# Altium project Compact Inverter Driver V5.PrjPcb (part 1 of 2)
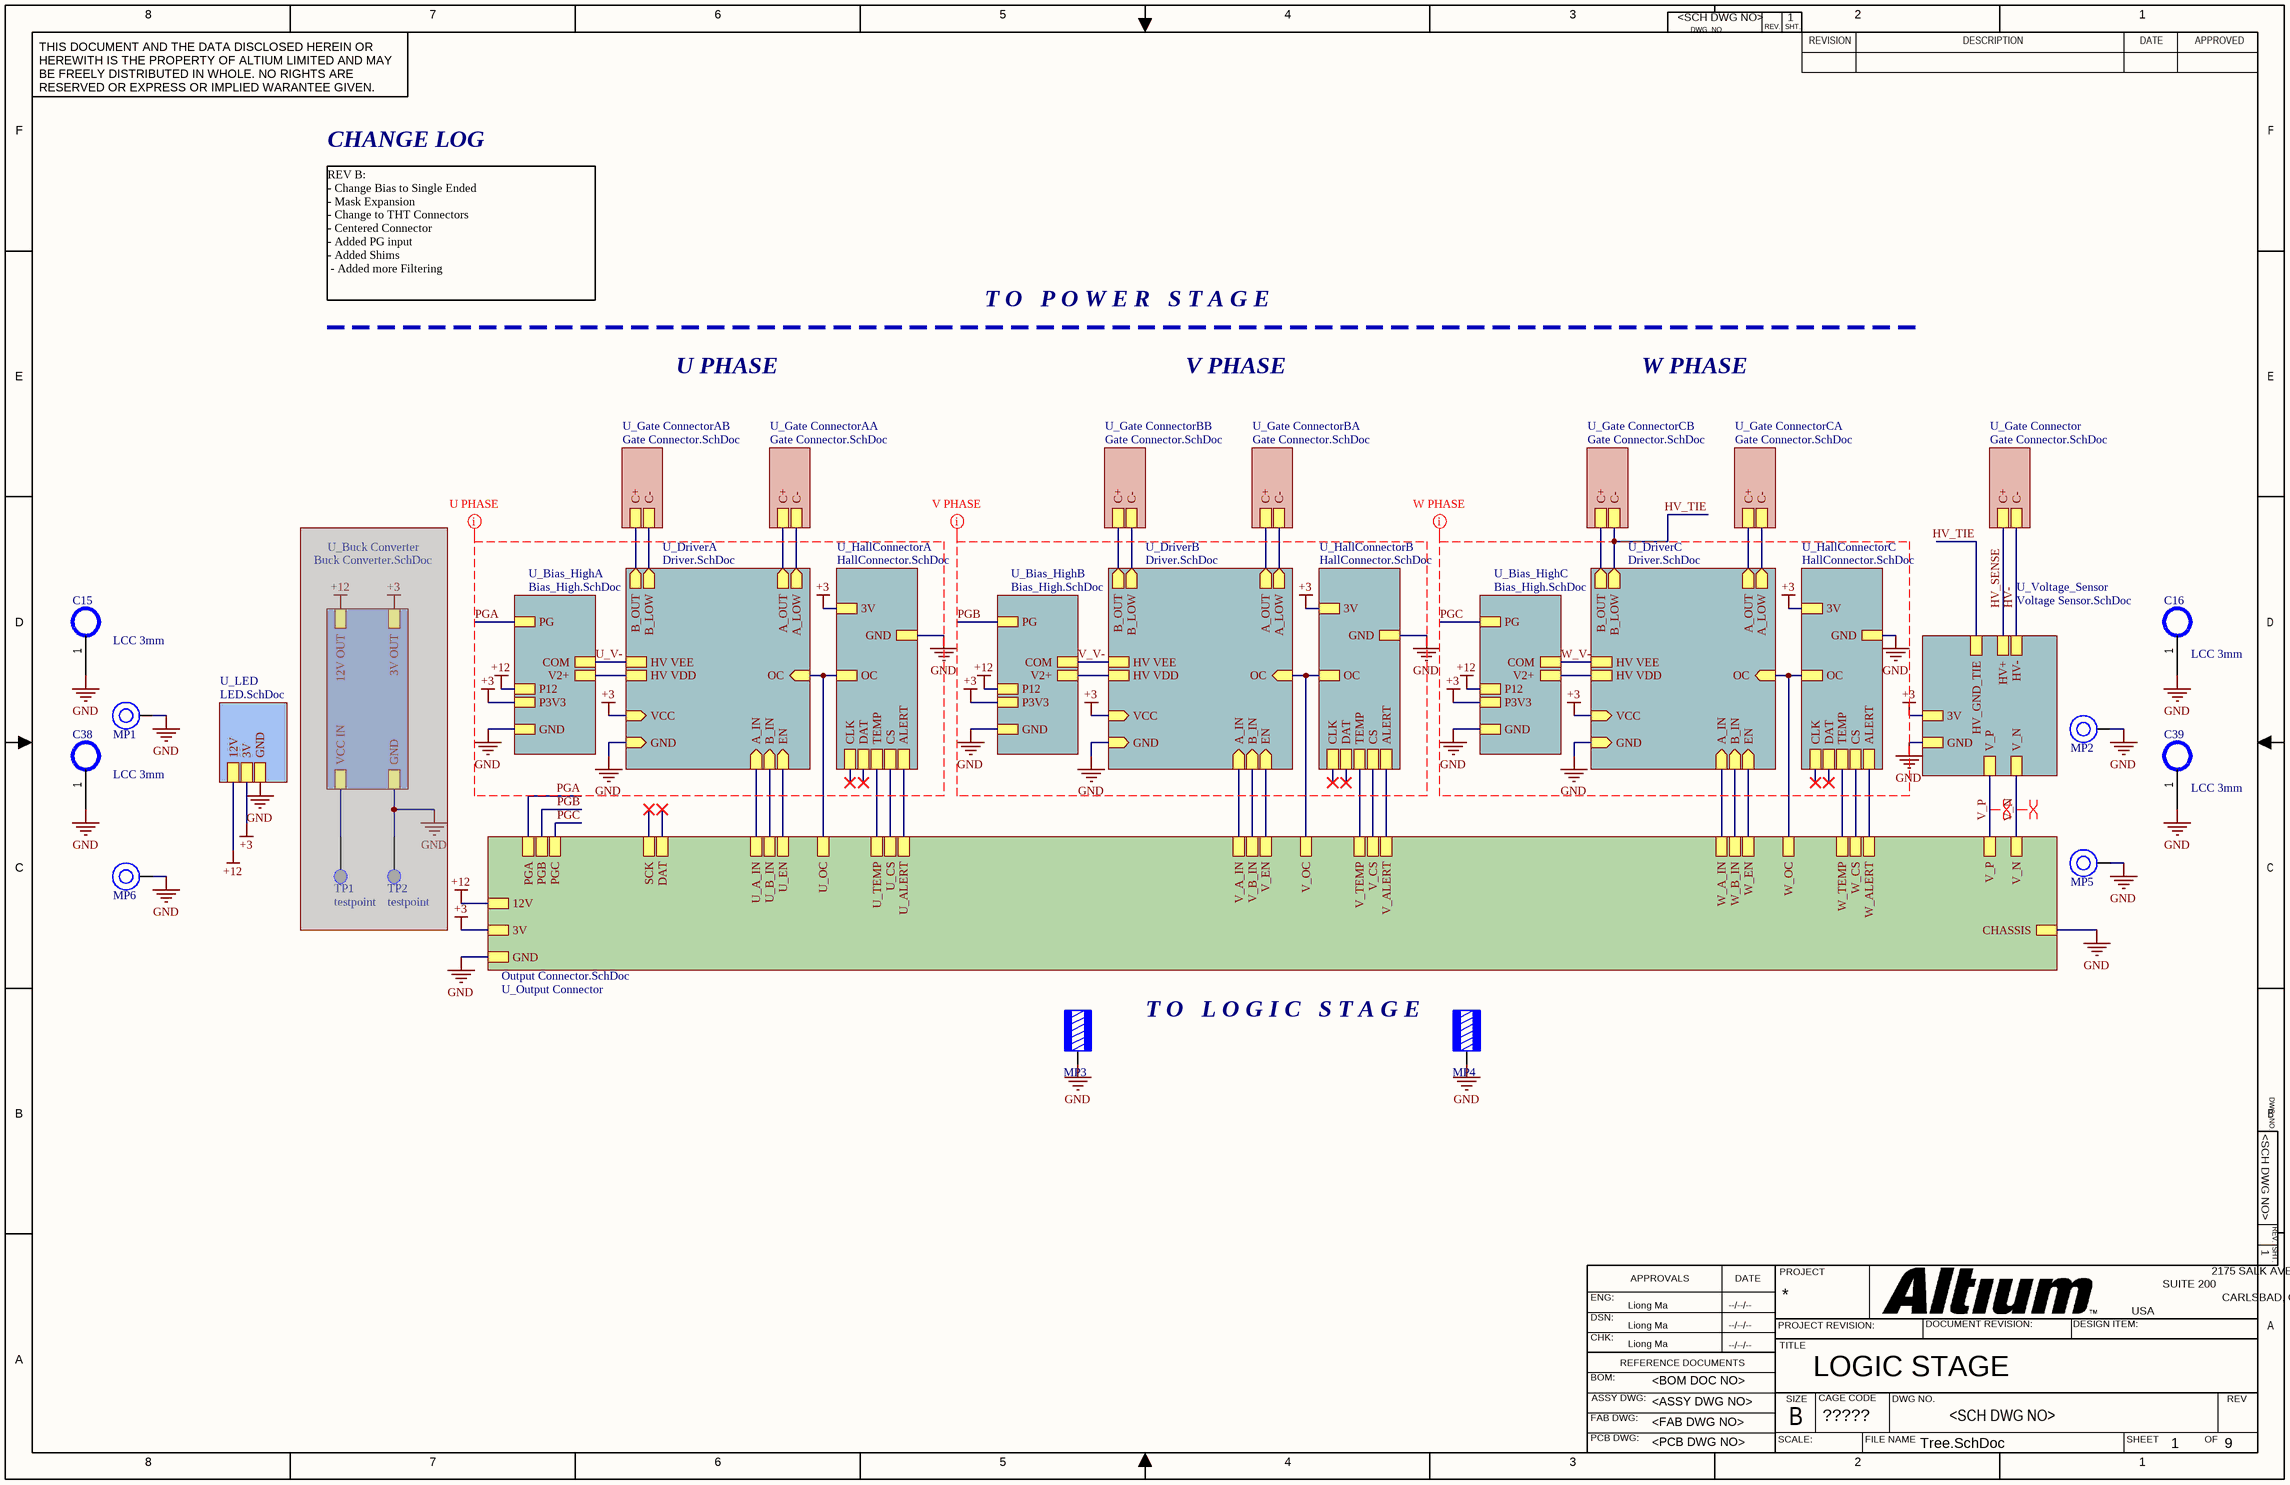
[diagram p0: Tree.SchDoc]
CAGE_CODE: ?????; CONTRACT_NUMBER: <CONTRACT NO>; DOC_NO_ASSY_DWG: <ASSY DWG NO>; DOC_NO_BOM: <BOM DOC NO>; DOC_NO_FAB_DWG: <FAB DWG NO>; DOC_NO_SCH_DWG: <SCH DWG NO>; PCB_2_DEC_TOL: +/-.01; PCB_3_DEC_TOL: +/-.010; PCB_ANG_TOL: +/-1/2; PCB_ASSEMBLY_NO: <PCB ASSY NO>; PCB_CHECKER: - -----; PCB_CHECKER_APP_DATE: --/--/----; PCB_DESIGNER: - -----; PCB_DESIGNER_APP_DATE: --/--/----; PCB_DWG_NO: <PCB DWG NO>; PCB_ENGINEER: - -----; PCB_ENGINEER_APP_DATE: --/--/----; PCB_PART_NUMBER: <PCB PN>; PCB_REV: A; SCH_REV: A
9 sheets, 165 parts. Net scope: strictly hierarchical (ports join the sheet entries above them; power ports are local).
Board file: PCB1.PcbDoc
Sheets:
  Tree.SchDoc
    U_DriverA = Driver.SchDoc
    U_Bias_HighA = Bias_High.SchDoc
    U_HallConnectorA = HallConnector.SchDoc
    U_Gate ConnectorAB = Gate Connector.SchDoc
    U_Gate ConnectorAA = Gate Connector.SchDoc
    U_Output Connector = Output Connector.SchDoc
    U_DriverB = Driver.SchDoc
    U_Bias_HighB = Bias_High.SchDoc
    U_HallConnectorB = HallConnector.SchDoc
    U_Gate ConnectorBB = Gate Connector.SchDoc
    U_Gate ConnectorBA = Gate Connector.SchDoc
    U_DriverC = Driver.SchDoc
    U_Bias_HighC = Bias_High.SchDoc
    U_HallConnectorC = HallConnector.SchDoc
    U_Gate ConnectorCB = Gate Connector.SchDoc
    U_Gate ConnectorCA = Gate Connector.SchDoc
    U_Voltage_Sensor = Voltage Sensor.SchDoc
    U_Gate Connector = Gate Connector.SchDoc
    U_LED = LED.SchDoc

## Sheet Tree.SchDoc: LOGIC STAGE
size 431 x 279 mm; Date: 3/1/25; CheckedBy: Liong Ma; Author: Liong Ma; CompanyName: N/A; DrawnBy: Liong Ma; Engineer: Liong Ma; DocumentNumber: 2; Revision: 1; SheetNumber: 1; SheetTotal: 9; ENG_APP_DATE: --/--/--; DSN_APP_DATE: --/--/--; CHK_APP_DATE: --/--/--

### Parts
C15  LCC 3mm  [PAD 3MM - duplicate]
C16  LCC 3mm  [PAD 3MM - duplicate]
C38  LCC 3mm  [PAD 3MM - duplicate]
C39  LCC 3mm  [PAD 3MM - duplicate]
MP1  M3 x 6.6mm  [9775066360]  (value not drawn)
MP2  M3 x 6.6mm  [9775066360]  (value not drawn)
MP3  M3  [7466313]  (value not drawn)
MP4  M3  [7466313]  (value not drawn)
MP5  M3 x 2.6mm  [9775026360]  (value not drawn)
MP6  M3 x 2.6mm  [9775026360]  (value not drawn)
TP1  testpoint  [testpoint-hook-0805]  (masked out: inside a compile mask, not in the netlist)
TP2  testpoint  [testpoint-hook-0805]  (masked out: inside a compile mask, not in the netlist)

### Sub-sheets
U_Bias_HighA = Bias_High.SchDoc: P12, P3V3, V2+, COM, PG, GND
U_Bias_HighB = Bias_High.SchDoc: P12, P3V3, V2+, COM, PG, GND
U_Bias_HighC = Bias_High.SchDoc: P12, P3V3, V2+, COM, PG, GND
U_Buck Converter = Buck Converter.SchDoc (masked out): VCC IN, GND, 12V OUT, 3V OUT
U_DriverA = Driver.SchDoc: B_OUT (out), B_LOW (out), EN (in), OC (in), A_OUT (out), A_LOW (out), A_IN (in), B_IN (in), VCC (in), GND (in), HV VEE, HV VDD
U_DriverB = Driver.SchDoc: B_OUT (out), B_LOW (out), EN (in), OC (in), A_OUT (out), A_LOW (out), A_IN (in), B_IN (in), VCC (in), GND (in), HV VEE, HV VDD
U_DriverC = Driver.SchDoc: B_OUT (out), B_LOW (out), EN (in), OC (in), A_OUT (out), A_LOW (out), A_IN (in), B_IN (in), VCC (in), GND (in), HV VEE, HV VDD
U_Gate Connector = Gate Connector.SchDoc: C-, C+
U_Gate ConnectorAA = Gate Connector.SchDoc: C-, C+
U_Gate ConnectorAB = Gate Connector.SchDoc: C-, C+
U_Gate ConnectorBA = Gate Connector.SchDoc: C-, C+
U_Gate ConnectorBB = Gate Connector.SchDoc: C-, C+
U_Gate ConnectorCA = Gate Connector.SchDoc: C-, C+
U_Gate ConnectorCB = Gate Connector.SchDoc: C-, C+
U_HallConnectorA = HallConnector.SchDoc: CLK, DAT, CS, 3V, OC, ALERT, GND, TEMP
U_HallConnectorB = HallConnector.SchDoc: CLK, DAT, CS, 3V, OC, ALERT, GND, TEMP
U_HallConnectorC = HallConnector.SchDoc: CLK, DAT, CS, 3V, OC, ALERT, GND, TEMP
U_LED = LED.SchDoc: 12V, 3V, GND
U_Output Connector = Output Connector.SchDoc: U_CS, U_ALERT, U_OC, U_A_IN, U_B_IN, SCK, DAT, 3V, 12V, GND, U_EN, V_CS, V_ALERT, V_OC, V_A_IN, V_B_IN, V_EN, W_CS, W_ALERT, W_OC, W_A_IN, W_B_IN, W_EN, V_P, V_N, CHASSIS, W_TEMP, V_TEMP, U_TEMP, PGA, PGB, PGC
U_Voltage_Sensor = Voltage Sensor.SchDoc: V_P, V_N, HV+, HV-, 3V, GND, HV_GND_TIE

### Nets
+3: sheet U_DriverA/VCC, sheet U_Bias_HighA/P3V3, sheet U_HallConnectorA/3V, sheet U_Output Connector/3V, sheet U_DriverB/VCC, sheet U_Bias_HighB/P3V3, sheet U_HallConnectorB/3V, sheet U_DriverC/VCC, sheet U_Bias_HighC/P3V3, sheet U_HallConnectorC/3V, sheet U_Voltage_Sensor/3V, sheet U_LED/3V  [project net 3V]
+12: sheet U_Bias_HighA/P12, sheet U_Output Connector/12V, sheet U_Bias_HighB/P12, sheet U_Bias_HighC/P12, sheet U_LED/12V  [project net 12V]
GND: C15.1 C16.1 C38.1 C39.1 MP1.1 MP2.1 MP3.1 MP4.1 MP5.1 MP6.1 ; sheet U_DriverA/GND, sheet U_Bias_HighA/GND, sheet U_HallConnectorA/GND, sheet U_Output Connector/GND, sheet U_Output Connector/CHASSIS, sheet U_DriverB/GND, sheet U_Bias_HighB/GND, sheet U_HallConnectorB/GND, sheet U_DriverC/GND, sheet U_Bias_HighC/GND, sheet U_HallConnectorC/GND, sheet U_Voltage_Sensor/GND, sheet U_LED/GND
HV-: sheet U_Voltage_Sensor/HV-, sheet U_Gate Connector/C-
HV_SENSE: sheet U_Voltage_Sensor/HV+, sheet U_Gate Connector/C+
HV_TIE: sheet U_DriverC/B_LOW, sheet U_DriverC/HV VEE, sheet U_Bias_HighC/COM, sheet U_Gate ConnectorCB/C-, sheet U_Voltage_Sensor/HV_GND_TIE  [also labelled W_V-]
J+: sheet U_DriverA/B_OUT, sheet U_Gate ConnectorAB/C+
J+: sheet U_DriverA/A_OUT, sheet U_Gate ConnectorAA/C+  [a separate net that carries the same name]
J+: sheet U_DriverB/B_OUT, sheet U_Gate ConnectorBB/C+  [a separate net that carries the same name]
J+: sheet U_DriverB/A_OUT, sheet U_Gate ConnectorBA/C+  [a separate net that carries the same name]
J+: sheet U_DriverC/B_OUT, sheet U_Gate ConnectorCB/C+  [a separate net that carries the same name]
J+: sheet U_DriverC/A_OUT, sheet U_Gate ConnectorCA/C+  [a separate net that carries the same name]
J-: sheet U_DriverA/A_LOW, sheet U_Gate ConnectorAA/C-
J-: sheet U_DriverB/A_LOW, sheet U_Gate ConnectorBA/C-  [a separate net that carries the same name]
J-: sheet U_DriverC/A_LOW, sheet U_Gate ConnectorCA/C-  [a separate net that carries the same name]
PGA: sheet U_Bias_HighA/PG, sheet U_Output Connector/PGA  [project net FAULT]
PGB: sheet U_Output Connector/PGB, sheet U_Bias_HighB/PG  [project net FAULT]
PGC: sheet U_Output Connector/PGC, sheet U_Bias_HighC/PG  [project net FAULT]
U_V-: sheet U_DriverA/B_LOW, sheet U_DriverA/HV VEE, sheet U_Bias_HighA/COM, sheet U_Gate ConnectorAB/C-  [project net J-]
V_N: sheet U_Output Connector/V_N, sheet U_Voltage_Sensor/V_N
V_P: sheet U_Output Connector/V_P, sheet U_Voltage_Sensor/V_P
V_V-: sheet U_DriverB/B_LOW, sheet U_DriverB/HV VEE, sheet U_Bias_HighB/COM, sheet U_Gate ConnectorBB/C-  [project net J-]
VCC: sheet U_DriverA/HV VDD, sheet U_Bias_HighA/V2+
VCC: sheet U_DriverB/HV VDD, sheet U_Bias_HighB/V2+  [a separate net that carries the same name]
VCC: sheet U_DriverC/HV VDD, sheet U_Bias_HighC/V2+  [a separate net that carries the same name]
NetJ1_U_HallConnectorA_2: sheet U_DriverA/OC, sheet U_HallConnectorA/OC, sheet U_Output Connector/U_OC
NetJ1_U_HallConnectorA_3: sheet U_HallConnectorA/CS, sheet U_Output Connector/U_CS
NetJ1_U_HallConnectorA_6: sheet U_HallConnectorA/ALERT, sheet U_Output Connector/U_ALERT
NetJ1_U_HallConnectorA_8: sheet U_HallConnectorA/TEMP, sheet U_Output Connector/U_TEMP
NetJ1_U_HallConnectorB_2: sheet U_Output Connector/V_OC, sheet U_DriverB/OC, sheet U_HallConnectorB/OC
NetJ1_U_HallConnectorB_3: sheet U_Output Connector/V_CS, sheet U_HallConnectorB/CS
NetJ1_U_HallConnectorB_6: sheet U_Output Connector/V_ALERT, sheet U_HallConnectorB/ALERT
NetJ1_U_HallConnectorB_8: sheet U_Output Connector/V_TEMP, sheet U_HallConnectorB/TEMP
NetJ1_U_HallConnectorC_2: sheet U_Output Connector/W_OC, sheet U_DriverC/OC, sheet U_HallConnectorC/OC
NetJ1_U_HallConnectorC_3: sheet U_Output Connector/W_CS, sheet U_HallConnectorC/CS
NetJ1_U_HallConnectorC_6: sheet U_Output Connector/W_ALERT, sheet U_HallConnectorC/ALERT
NetJ1_U_HallConnectorC_8: sheet U_Output Connector/W_TEMP, sheet U_HallConnectorC/TEMP
NetJ3_02: sheet U_Output Connector/V_A_IN, sheet U_DriverB/A_IN
NetJ3_04: sheet U_Output Connector/V_B_IN, sheet U_DriverB/B_IN
NetJ3_06: sheet U_Output Connector/V_EN, sheet U_DriverB/EN
NetJ3_07: sheet U_Output Connector/W_EN, sheet U_DriverC/EN
NetJ3_09: sheet U_Output Connector/W_B_IN, sheet U_DriverC/B_IN
NetJ3_11: sheet U_Output Connector/W_A_IN, sheet U_DriverC/A_IN
NetJ3_30: sheet U_DriverA/A_IN, sheet U_Output Connector/U_A_IN
NetJ3_32: sheet U_DriverA/B_IN, sheet U_Output Connector/U_B_IN
NetJ3_34: sheet U_DriverA/EN, sheet U_Output Connector/U_EN

### Layout directives
differential pair: V_N, V_P
CompClassName: U PHASE: +3, +12, GND, PGA, U_V-
CompClassName: V PHASE: +3, +12, GND, PGB, V_V-
CompClassName: W PHASE: +3, +12, GND, PGC, W_V-

### Notes on the sheet
- CHANGE LOG
- REV B:
  - Change Bias to Single Ended
  - Mask Expansion
  - Change to THT Connectors
  - Centered Connector
  - Added PG input
  - Added Shims
  - Added more Filtering
- T O   P O W E R   S T A G E
- U PHASE
- V PHASE
- W PHASE
- (near MP4) T O   L O G I C   S T A G E
- 8
- 7
- 6
- 5
- 4
- 3
- DWG. NO.
- REV.
- SHT.
- 2
- 1
- THIS DOCUMENT AND THE DATA DISCLOSED HEREIN OR HEREWITH IS THE PROPERTY OF ALTIUM LIMITED AND MAY BE FREELY DISTRIBUTED IN WHOLE. NO RIGHTS ARE RESERVED OR EXPRESS OR IMPLIED WARANTEE GIVEN.
- REVISION
- DESCRIPTION
- DATE
- APPROVED
- F
- E
- D
- C
- B
- ENG:
- APPROVALS
- PROJECT
- SUITE 200
- 2175 SALK AVENUE
- CARLSBAD, CA 92008
- A
- DSN:
- CHK:
- REFERENCE DOCUMENTS
- PROJECT REVISION:
- TITLE
- DOCUMENT REVISION:
- DESIGN ITEM:
- USA
- BOM:
- FAB DWG:
- PCB DWG:
- ASSY DWG:
- SCALE:
- SIZE
- CAGE CODE
- FILE NAME
- DWG NO.
- SHEET
- OF
- REV

### Library data of the parts
MP1 MP2 = 9775066360R: WA-SMSR SMT Steel Spacer Reverse, M3 x 6.6mm; Manufacturer: Wurth Elektronik; Inside Diameter: 4.2mm; Outside Diameter: 6mm; Surface: Tin; ComponentLink1Description: Website Link; ComponentLink1URL: https://www.we-online.com/redexpert/article/9775066360R?ad; ComponentLink2Description: Datasheet Link; ComponentLink2URL: https://www.we-online.com/redexpert/spec/9775066360R?ad; Manufacturer Part Number: 9775066360R; Category: SMT Spacers; Match Code: WA-SMSR; Mount: Surface Mount; Operating Temperature Max: 150°C; Operating Temperature Min: -55°C; Packaging: Tape and Reel; Material: Steel; Pin Length: 6.6mm; Thread Size: M3
MP3 MP4 = 7466313R: WP-SMRA REDCUBE SMT Right Angled with pins, M3, 50A; Manufacturer: Wurth Elektronik; Surface: Tin; ComponentLink1Description: Website Link; ComponentLink1URL: https://www.we-online.com/redexpert/article/7466313R?ad; ComponentLink2Description: Datasheet Link; ComponentLink2URL: https://www.we-online.com/redexpert/spec/7466313R?ad; Manufacturer Part Number: 7466313R; Category: REDCUBE SMT; Match Code: WP-SMRA; Mount: Surface Mount; Operating Temperature Max: 150°C; Operating Temperature Min: -55°C; Packaging: Tape and Reel; Height: 7mm; Material: Brass; Rated Current: 50A; Thread Size: M3
MP5 MP6 = 9775026360R: WA-SMSR SMT Steel Spacer Reverse, M3 x 2.6mm; Manufacturer: Wurth Elektronik; Inside Diameter: 4.2mm; Outside Diameter: 6mm; Surface: Tin; ComponentLink1Description: Website Link; ComponentLink1URL: https://www.we-online.com/redexpert/article/9775026360R?ad; ComponentLink2Description: Datasheet Link; ComponentLink2URL: https://www.we-online.com/redexpert/spec/9775026360R?ad; Manufacturer Part Number: 9775026360R; Category: SMT Spacers; Match Code: WA-SMSR; Mount: Surface Mount; Operating Temperature Max: 150°C; Operating Temperature Min: -55°C; Packaging: Tape and Reel; Material: Steel; Pin Length: 2.6mm; Thread Size: M3
TP1 TP2 = CMP-022-000000-1: Source: Misc-components.SchLib; Design Item ID: testpoint

## Sheet Driver.SchDoc
size A; SheetNumber: 3; SheetTotal: 9
Used 3 times, as channels U_DriverA, U_DriverB, U_DriverC. Parts and nets are listed once, with the designators drawn on the sheet.
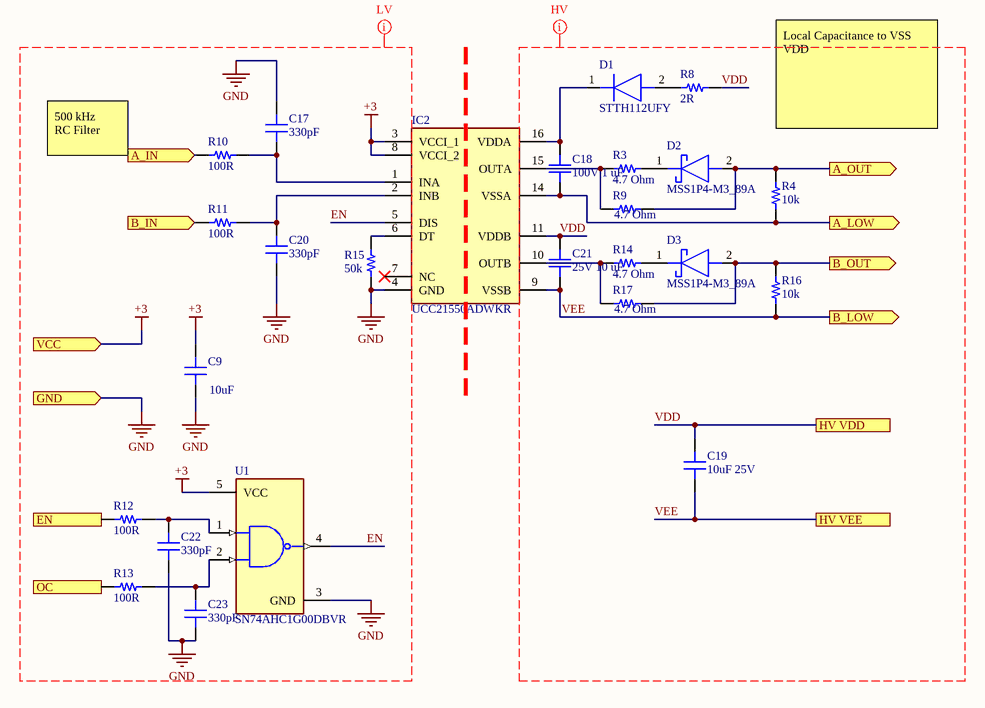
[diagram p1: Driver.SchDoc]

### Parts
C9  10uF  [CAP 0805_2012]
C17  330pF  [CAP 0402_1005]
C18  100V 1 uF  [CAP 1206_3216 - 0.8MM]
C19  10uF 25V  [CAP 1210_3225 - 1MM]
C20  330pF  [CAP 0402_1005]
C21  25V 10 uF  [CAP 1206_3216 - 0.8MM]
C22  330pF  [CAP 0402_1005]
C23  330pF  [CAP 0402_1005]
D1  STTH112UFY  [DIOM5436X110N]
D2  MSS1P4-M3_89A  [MICROSMP]
D3  MSS1P4-M3_89A  [MICROSMP]
IC2  UCC21550ADWKR  [UCC21550ADWKR]
R3  4.7 Ohm  [YAGEO RES 1206_3216]
R4  10k  [RES 0402_1005]
R8  2R  [YAGEO RES 1206_3216]
R9  4.7 Ohm  [YAGEO RES 1206_3216]
R10  100R  [RES 0402_1005]
R11  100R  [RES 0402_1005]
R12  100R  [RES 0402_1005]
R13  100R  [RES 0402_1005]
R14  4.7 Ohm  [YAGEO RES 1206_3216]
R15  50k  [RES 0402_1005]
R16  10k  [RES 0402_1005]
R17  4.7 Ohm  [YAGEO RES 1206_3216]
U1  SN74AHC1G00DBVR  [FP-DBV0005A-MFG]

### Ports
A_IN (in), A_LOW (out), A_OUT (out), B_IN (in), B_LOW (out), B_OUT (out), EN (in), GND (in), HV VDD, HV VEE, OC (in), VCC (in)

### Nets
+3: C9.2 IC2.3(VCCI_1) IC2.8(VCCI_2) U1.5(VCC) ; port VCC
GND: C9.1 C17.2 C20.1 C22.1 C23.1 IC2.4(GND) R15.2 U1.3(GND) ; port GND
A_IN: R10.1 ; port A_IN
A_LOW: C18.1 IC2.14(VSSA) R4.2 ; port A_LOW
A_OUT: D2.2(A) R4.1 R9.2 ; port A_OUT
B_IN: R11.1 ; port B_IN
B_OUT: D3.2(A) R16.1 R17.2 ; port B_OUT
EN: IC2.5(DIS) U1.4(Y)
EN: R12.1 ; port EN  [a separate net that carries the same name]
OC: R13.1 ; port OC
VDD: C19.1 C21.2 IC2.11(VDDB) R8.1 ; port HV VDD
VEE: C19.2 C21.1 IC2.9(VSSB) R16.2 ; port B_LOW, port HV VEE
NetC17_1: C17.1 IC2.1(INA) R10.2
NetC18_2: C18.2 D1.1(K) IC2.16(VDDA)
NetC20_2: C20.2 IC2.2(INB) R11.2
NetC22_2: C22.2 R12.2 U1.1(A)
NetC23_2: C23.2 R13.2 U1.2(B)
NetD1_2: D1.2(A) R8.2
NetD2_1: D2.1(K) R3.2
NetD3_1: D3.1(K) R14.2
NetIC2_6: IC2.6(DT) R15.1
NetIC2_10: IC2.10(OUTB) R14.1 R17.1
NetIC2_15: IC2.15(OUTA) R3.1 R9.1

Not connected (* = marked no-connect by the designer): IC2 7(NC)*

### Channels
U_DriverA: designators end in _U_DriverA; ports A_IN=NetJ3_30 A_LOW=J- A_OUT=J+ B_IN=NetJ3_32 B_LOW=J- B_OUT=J+ EN=NetJ3_34 GND=GND HV VDD=VCC HV VEE=J- OC=NetJ1_U_HallConnectorA_2 VCC=3V
U_DriverB: designators end in _U_DriverB; ports A_IN=NetJ3_02 A_LOW=J- A_OUT=J+ B_IN=NetJ3_04 B_LOW=J- B_OUT=J+ EN=NetJ3_06 GND=GND HV VDD=VCC HV VEE=J- OC=NetJ1_U_HallConnectorB_2 VCC=3V
U_DriverC: designators end in _U_DriverC; ports A_IN=NetJ3_11 A_LOW=J- A_OUT=J+ B_IN=NetJ3_09 B_LOW=HV_TIE B_OUT=J+ EN=NetJ3_07 GND=GND HV VDD=VCC HV VEE=HV_TIE OC=NetJ1_U_HallConnectorC_2 VCC=3V

### Layout directives
net class HV: VDD, VEE
net class LV: +3, EN, GND

### Notes on the sheet
- 500 kHz
  RC Filter
- Local Capacitance to VSS VDD

### Library data of the parts
C9 = CGA4J3X7R1C155M125AB: CAP CER 1.5UF 16V X7R 0805; manufacturer: TDK Corporation; Capacitance: 1.5 µF; Tolerance: ±20%; value: 1.5 µF; Part Number: CGA4J3X7R1C155M125AB; Applications: Automotive; componentlink1description: Datasheet; componentlink1url: https://product.tdk.com/info/en/catalog/datasheets/mlcc_automotive_general_en.pdf?ref_disty=digikey; componentlink2description: DigiKey Link; componentlink2url: https://www.digikey.com/en/products/detail/tdk-corporation/CGA4J3X7R1C155M125AB/3949968; Device Package: 0805 (2012 Metric); lastupdated: 2/9/2024 8:15:20 PM; Lifecycle Status: Active; Minimum Order: 1; Mounting Type: Surface Mount, MLCC; Operating Temperature: -55°C ~ 125°C; Package / Case: 0805 (2012 Metric); packaging: TapeAndReel; partid: 18072; Part Status: Active; price: 0.04; Ratings: AEC-Q200; series: CGA; Size / Dimension: 0.079" L x 0.049" W (2.00mm x 1.25mm); Supplier 1: DigiKey; Supplier Part Number 1: 445-12732-1-ND; Temperature Coefficient: X7R; Thickness (Max): 0.057" (1.45mm); Voltage - Rated: 16V
C17 C20 C22 C23 = ZRB157R61E225KE11D: CAP CER 2F 25V X5R 0402; manufacturer: Murata Electronics; Capacitance: 2.2 µF; Tolerance: ±10%; value: 2.2 µF; Part Number: ZRB157R61E225KE11D; Applications: Acoustic Noise Reduction; componentlink1description: Datasheet; componentlink1url: https://search.murata.co.jp/Ceramy/image/img/A01X/G101/ENG/ZRB157R61E225KE11-01.pdf; componentlink2description: DigiKey Link; componentlink2url: https://www.digikey.com/en/products/detail/murata-electronics/ZRB157R61E225KE11D/5321074; Device Package: 0402 (1005 Metric); Features: Interposer Termination; lastupdated: 2/9/2024 8:04:27 PM; Lifecycle Status: Active; Minimum Order: 1; Mounting Type: Surface Mount, MLCC; Operating Temperature: -55°C ~ 85°C; Package / Case: 0402 (1005 Metric); packaging: TapeAndReel; partid: 8590; Part Status: Active; price: 0.04; series: ZRB; Size / Dimension: 0.039" L x 0.020" W (1.00mm x 0.50mm); Supplier 1: DigiKey; Supplier Part Number 1: 490-10982-1-ND; Temperature Coefficient: X5R; Thickness (Max): 0.033" (0.85mm); Voltage - Rated: 25V
C18 C21 = VPDD631W103K1GV001E: HV CAP 0.01F 630V 1206 X7R; manufacturer: Johanson Dielectrics Inc.; Capacitance: 10000 pF; Tolerance: ±10%; value: 10000 pF; Part Number: VPDD631W103K1GV001E; Applications: General Purpose; componentlink1description: Datasheet; componentlink1url: https://www.johansondielectrics.com/datasheets/export/e1.php?name=VPDD631W103K1GV001E; componentlink2description: DigiKey Link; componentlink2url: https://www.digikey.com/en/products/detail/johanson-dielectrics-inc/VPDD631W103K1GV001E/21283575; Device Package: 1206 (3216 Metric); Features: High Voltage; lastupdated: 6/4/2024 7:09:59 PM; Lifecycle Status: Active; Minimum Order: 1; Mounting Type: Surface Mount, MLCC; Operating Temperature: -55°C ~ 125°C; Package / Case: 1206 (3216 Metric); packaging: TapeAndReel; partid: 57082; price: 0.02; series: HVS-PME; Size / Dimension: 0.125" L x 0.062" W (3.17mm x 1.57mm); Supplier 1: DigiKey; Supplier Part Number 1: 709-VPDD631W103K1GV001ECT-ND; Temperature Coefficient: X7R; Thickness (Max): 0.067" (1.70mm); Voltage - Rated: 630V
C19 = MSAST32NSB5106MTNA01: CAP CER 10UF 25V X5R 1210; manufacturer: Taiyo Yuden; Value: 10 µF; Tolerance: ±20%; Part Number: MSAST32NSB5106MTNA01; Applications: SMPS Filtering; Capacitance: 10 µF; componentlink1description: Datasheet; componentlink1url: https://mm.digikey.com/Volume0/opasdata/d220001/medias/docus/5731/MSR01_e.pdf; componentlink2description: DigiKey Link; componentlink2url: https://www.digikey.com/en/products/detail/taiyo-yuden/MSAST32NSB5106MTNA01/16661899; Device Package: 1210 (3225 Metric); lastupdated: 6/4/2024 7:20:40 PM; Lifecycle Status: Active; Minimum Order: 1; Mounting Type: Surface Mount, MLCC; Operating Temperature: -55°C ~ 85°C; Package / Case: 1210 (3225 Metric); packaging: TapeAndReel; partid: 58126; price: 0.08; series: MSAS; Size / Dimension: 0.126" L x 0.098" W (3.20mm x 2.50mm); Supplier 1: DigiKey; Supplier Part Number 1: 587-MSAST32NSB5106MTNA01CT-ND; Temperature Coefficient: X5R; Thickness (Max): 0.083" (2.10mm); Voltage - Rated: 25V
D1 = STTH112UFY: Diode; Manufacturer_Name: STMicroelectronics; Datasheet Link: https://www.st.com/resource/en/datasheet/stth112-y.pdf; Height: 1.1mm; Manufacturer_Part_Number: STTH112UFY; Mouser Part Number: 511-STTH112UFY; Mouser Price/Stock: https://www.mouser.co.uk/ProductDetail/STMicroelectronics/STTH112UFY?qs=DqCdCwOw4%2F7HJr4wLNNIMw%3D%3D; Arrow Part Number: STTH112UFY; Arrow Price/Stock: https://www.arrow.com/en/products/stth112ufy/stmicroelectronics?region=europe
D2 D3 = MSS1P4-M3_89A: Schottky Diode; Manufacturer_Name: Vishay; Manufacturer_Part_Number: MSS1P4-M3/89A; Datasheet Link: https://www.vishay.com/docs/89019/mss1p4.pdf; Mouser Part Number: 625-MSS1P4-M3; Mouser Price/Stock: https://www.mouser.co.uk/ProductDetail/Vishay-General-Semiconductor/MSS1P4-M3-89A?qs=fLSHF8TigmUkO6GnwlXAxQ%3D%3D; Arrow Part Number: MSS1P4-M3/89A; Arrow Price/Stock: https://www.arrow.com/en/products/mss1p4-m389a/vishay?utm_currency=USD&region=nac
IC2 = UCC21550ADWKR: Integrated Circuit; Manufacturer_Name: Texas Instruments; Datasheet Link: https://www.ti.com/lit/gpn/UCC21550; Height: 2.65mm; Manufacturer_Part_Number: UCC21550ADWKR; Mouser Part Number: 595-UCC21550ADWKR; Mouser Price/Stock: https://www.mouser.co.uk/ProductDetail/Texas-Instruments/UCC21550ADWKR?qs=IKkN%2F947nfBAXILs21qR6A%3D%3D; Arrow Part Number: UCC21550ADWKR; Arrow Price/Stock: https://www.arrow.com/en/products/ucc21550adwkr/texas-instruments?utm_currency=USD&region=nac
R3 R8 R9 R14 R17 = RL1206FR-7W0R1L: RES 0.1 OHM 1% 1/2W 1206; Manufacturer: Yageo; Power (Watts): 0.5W, 1/2W; Resistance: 100 mOhms; Temperature Coefficient: ±600ppm/°C; Value: 100 mOhms; Part Number: RL1206FR-7W0R1L; ComponentLink1Description: Datasheet; ComponentLink1URL: http://www.yageo.com/documents/recent/PYu-RL_Group_521_RoHS_L_2.pdf; ComponentLink2Description: DigiKey Link; ComponentLink2URL: https://www.digikey.com/en/products/detail/yageo/RL1206FR-7W0R1L/2827682; Composition: Thick Film; Device Package: 1206 (3216 Metric); Features: Current Sense; Height - Seated (Max): 0.026" (0.65mm); LastUpdated: 7/25/2024 9:21:39 AM; Lifecycle Status: Active; Minimum Order: 1; Number of Terminations: 2; Operating Temperature: -55°C ~ 125°C; Package / Case: 1206 (3216 Metric); Packaging: TapeAndReel; PartId: 26837; Part Status: Active; Price: 0.08; Ratings: AEC-Q200; Series: RL; Size / Dimension: 0.122" L x 0.063" W (3.10mm x 1.60mm); Supplier 1: DigiKey; Supplier Part Number 1: 311-0.1LYCT-ND; Supplier Device Package: 1206; Tolerance: ±1%
R4 R10-R13 R15 R16 = RP73PF1E249KBTD: RES 249K OHM 0.1% 1/10W 0402; Manufacturer: TE Connectivity Passive Product; Value: 249 kOhms; Power (Watts): 0.1W, 1/10W; Temperature Coefficient: ±25ppm/°C; Part Number: RP73PF1E249KBTD; ComponentLink1Description: Datasheet; ComponentLink1URL: https://www.te.com/commerce/DocumentDelivery/DDEController?Action=srchrtrv&DocNm=1773272&DocType=DS&DocLang=English; ComponentLink2Description: DigiKey Link; ComponentLink2URL: https://www.digikey.com/en/products/detail/te-connectivity-passive-product/RP73PF1E249KBTD/8261091; Composition: Thin Film; Device Package: 0402 (1005 Metric); Height - Seated (Max): 0.014" (0.35mm); LastUpdated: 2/9/2024 8:30:24 PM; Lifecycle Status: Active; Minimum Order: 1; Number of Terminations: 2; Operating Temperature: -55°C ~ 155°C; Package / Case: 0402 (1005 Metric); Packaging: TapeAndReel; PartId: 2418; Part Status: Active; Price: 0.07; Resistance: 249 kOhms; Series: RP73, Holsworthy; Size / Dimension: 0.039" L x 0.020" W (1.00mm x 0.50mm); Supplier 1: DigiKey; Supplier Part Number 1: A127549CT-ND; Supplier Device Package: 0402; Tolerance: ±0.1%
U1 = CMP-0859-00172-4: IC GATE NAND 1CH 2-INP SOT23-5; Manufacturer: Texas Instruments; Standoff Height: 0mm; Number Of Outputs: 1; Nominal Supply Current: 1uA; Max Junction Temp: +150°C; Propagation Delay: 5.2ns; Min Supply Voltage: 2V; Max Supply Voltage: 5.5V; Number Of Inputs: 2; Category: IC; Logic Function Desc: NAND; Ambient Temperature Range High: +125°C; Automotive: No; Octopart: https://octopart.com/sn74ahc1g00dbvr-texas+instruments-464400; Device Class L1: Integrated Circuits (ICs); Device Class L2: Logic ICs; RoHS: TRUE; Height: 1.45mm; Digikey Description: IC GATE NAND 1CH 2-INP SOT23-5; Lead Free: Yes; Ambient Temperature Range Low: -40°C; Number Of Circuits: 1; Device Class L3: Logic Gates; Package: DBV0005A; Manufacturer Part Number: SN74AHC1G00DBVR; ComponentLink2URL: https://www.ti.com/lit/ds/symlink/sn74ahc1g00.pdf; Temperature Range Low: -40°C; Temperature: -40°C to +125°C; Temperature Range High: +125°C; ComponentLink2Description: Datasheet

## Sheet Bias_High.SchDoc
size A; SheetNumber: 2; SheetTotal: 9
Used 3 times, as channels U_Bias_HighA, U_Bias_HighB, U_Bias_HighC. Parts and nets are listed once, with the designators drawn on the sheet.
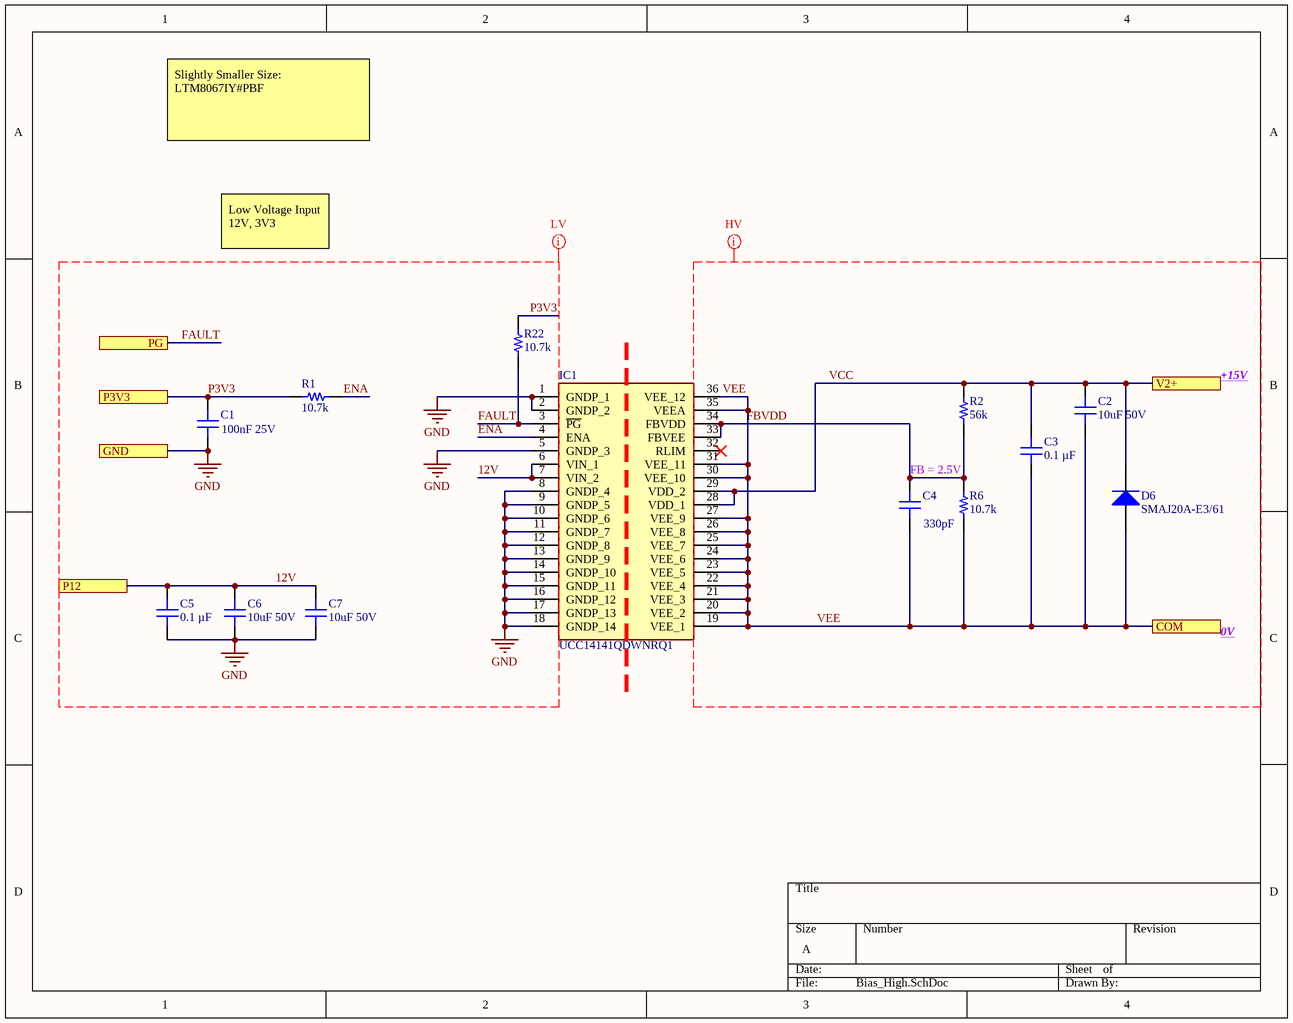
[diagram p2: Bias_High.SchDoc]

### Parts
C1  100nF 25V  [CAP 0402_1005]
C2  10uF 50V  [CAP 1210_3225 - 1MM]
C3  0.1 µF  [CAP 0603_1608]
C4  330pF  [CAP 0402_1005]
C5  0.1 µF  [CAP 0603_1608]
C6  10uF 50V  [CAP 1210_3225 - 1MM]
C7  10uF 50V  [CAP 1210_3225 - 1MM]
D6  SMAJ20A-E3/61  [VISH-DO-214AC-2_M]
IC1  UCC14141QDWNRQ1  [SOP65P1030X355-36N]
R1  10.7k  [RES 0402_1005]
R2  56k  [RES 0402_1005]
R6  10.7k  [RES 0402_1005]
R22  10.7k  [RES 0402_1005]

### Ports
COM, GND, P3V3, P12, PG, V2+

### Nets
GND: C1.1 C5.1 C6.2 C7.2 IC1.1(GNDP_1) IC1.2(GNDP_2) IC1.5(GNDP_3) IC1.8(GNDP_4) IC1.9(GNDP_5) IC1.10(GNDP_6) IC1.11(GNDP_7) IC1.12(GNDP_8) IC1.13(GNDP_9) IC1.14(GNDP_10) IC1.15(GNDP_11) IC1.16(GNDP_12) IC1.17(GNDP_13) IC1.18(GNDP_14) ; port GND
12V: C5.2 C6.1 C7.1 IC1.6(VIN_1) IC1.7(VIN_2) ; port P12
ENA: IC1.4(ENA) R1.1
FAULT: IC1.3(~{PG}) R22.2 ; port PG
FBVDD: C4.2 IC1.33(FBVEE) IC1.34(FBVDD) R2.1 R6.2
P3V3: C1.2 R1.2 R22.1 ; port P3V3
VCC: C2.1 C3.2 D6.1(K) IC1.28(VDD_1) IC1.29(VDD_2) R2.2 ; port V2+
VEE: C2.2 C3.1 C4.1 D6.2(A) IC1.19(VEE_1) IC1.20(VEE_2) IC1.21(VEE_3) IC1.22(VEE_4) IC1.23(VEE_5) IC1.24(VEE_6) IC1.25(VEE_7) IC1.26(VEE_8) IC1.27(VEE_9) IC1.30(VEE_10) IC1.31(VEE_11) IC1.35(VEEA) IC1.36(VEE_12) R6.1 ; port COM

Not connected (* = marked no-connect by the designer): IC1 32(RLIM)*

### Channels
U_Bias_HighA: designators end in _U_Bias_HighA; ports COM=J- GND=GND P3V3=3V P12=12V PG=FAULT V2+=VCC
U_Bias_HighB: designators end in _U_Bias_HighB; ports COM=J- GND=GND P3V3=3V P12=12V PG=FAULT V2+=VCC
U_Bias_HighC: designators end in _U_Bias_HighC; ports COM=HV_TIE GND=GND P3V3=3V P12=12V PG=FAULT V2+=VCC

### Layout directives
net class HV: FBVDD, VCC, VEE
net class LV: 12V, ENA, FAULT, GND, P3V3

### Notes on the sheet
- Slightly Smaller Size: LTM8067IY#PBF
- Low Voltage Input
  12V, 3V3
- +15V
- FB = 2.5V
- 0V

### Library data of the parts
C1 C4 = ZRB15XR60J106ME12D: CAP CER 10UF 6.3V X5R 0402; manufacturer: Murata Electronics; Capacitance: 10 µF; Tolerance: ±20%; value: 10 µF; Part Number: ZRB15XR60J106ME12D; Applications: Acoustic Noise Reduction; componentlink1description: Datasheet; componentlink1url: https://psearch.en.murata.com/capacitor/product/ZRB15XR60J106ME12%23.pdf; componentlink2description: DigiKey Link; componentlink2url: https://www.digikey.com/en/products/detail/murata-electronics/ZRB15XR60J106ME12D/5877414; Device Package: 0402 (1005 Metric); Features: Interposer Termination; lastupdated: 2/9/2024 8:04:31 PM; Lifecycle Status: Active; Minimum Order: 1; Mounting Type: Surface Mount, MLCC; Operating Temperature: -55°C ~ 85°C; Package / Case: 0402 (1005 Metric); packaging: TapeAndReel; partid: 6019; Part Status: Active; price: 0.03; series: ZRB; Size / Dimension: 0.039" L x 0.020" W (1.00mm x 0.50mm); Supplier 1: DigiKey; Supplier Part Number 1: 490-13251-1-ND; Temperature Coefficient: X5R; Thickness (Max): 0.031" (0.80mm); Voltage - Rated: 6.3V
C2 C6 C7 = MSAST32NSB5106MTNA01: as C19 on sheet Driver; Part Number: MSAST32NSB5106MTNA01; Applications: SMPS Filtering; Capacitance: 10 µF; componentlink1description: Datasheet; componentlink1url: https://mm.digikey.com/Volume0/opasdata/d220001/medias/docus/5731/MSR01_e.pdf; componentlink2description: DigiKey Link; componentlink2url: https://www.digikey.com/en/products/detail/taiyo-yuden/MSAST32NSB5106MTNA01/16661899; Device Package: 1210 (3225 Metric); lastupdated: 6/4/2024 7:20:40 PM; Lifecycle Status: Active; Minimum Order: 1; Mounting Type: Surface Mount, MLCC; Operating Temperature: -55°C ~ 85°C; Package / Case: 1210 (3225 Metric); packaging: TapeAndReel; partid: 58126; price: 0.08; series: MSAS; Size / Dimension: 0.126" L x 0.098" W (3.20mm x 2.50mm); Supplier 1: DigiKey; Supplier Part Number 1: 587-MSAST32NSB5106MTNA01CT-ND; Temperature Coefficient: X5R; Thickness (Max): 0.083" (2.10mm); Voltage - Rated: 25V
C3 C5 = C0603C104K5RAC7411: CAP CER 0.1UF 50V X7R 0603; manufacturer: KEMET; Tolerance: ±10%; Part Number: C0603C104K5RAC7411; Capacitance: 0.1 µF; Applications: Bypass, Decoupling; componentlink1description: Datasheet; componentlink1url: https://api.kemet.com/component-edge/download/datasheet/C0603C104K5RAC7411.pdf; componentlink2description: DigiKey Link; componentlink2url: https://www.digikey.com/en/products/detail/kemet/C0603C104K5RAC7411/3317013; Device Package: 0603 (1608 Metric); lastupdated: 2/9/2024 8:10:30 PM; Lifecycle Status: Active; Minimum Order: 1; Mounting Type: Surface Mount, MLCC; Operating Temperature: -55°C ~ 125°C; Package / Case: 0603 (1608 Metric); packaging: TapeAndReel; partid: 2233; Part Status: Active; price: 0.01; series: SMD Comm X7R; Size / Dimension: 0.063" L x 0.031" W (1.60mm x 0.80mm); Supplier 1: DigiKey; Supplier Part Number 1: 399-C0603C104K5RAC7411CT-ND; Temperature Coefficient: X7R; Thickness (Max): 0.035" (0.90mm); value: 0.1 µF; Voltage - Rated: 50V
D6 = CMP-0548-00226-2: Transient Voltage Suppressor, 6.40 to 231 V, 20 V Stand-off Voltage, Uni-Directional, -55 to 155 degC, 2-pin DO-214AC, Pb-Free, Tape and Reel; Manufacturer: Vishay Semiconductor; IFSM: 40 A; VWM (V): 20; PPPM (W): 400, 300; ID (uA): 1; VBR Uni-Directional (V): 6.4 to 231; PackageReference: DO-214AC-2; ComponentLink2URL: http://www.vishay.com/docs/88390/smaj50a.pdf; ComponentLink3Description: Package Specification; ComponentLink3URL: http://www.vishay.com/docs/88390/smaj50a.pdf; Mounting Technology: Surface Mount; Packing: Tape and Reel; PackageDescription: 2-Pin DO-214AC (SMA), Body 4.245 x 2.665 mm; PartNumber: SMAJ20A-E3/61; ComponentLink2Description: Datasheet; DatasheetVersion: 12/8/2013; Operating Junction and Storage Temperature Range: -55 to 150 degC; ComponentLink1URL: http://www.vishay.com/; ComponentLink1Description: Manufacturer URL; RoHS: TRUE
IC1 = UCC14141QDWNRQ1: Integrated Circuit; Manufacturer_Name: Texas Instruments; Datasheet Link: https://www.ti.com/lit/ds/symlink/ucc14141-q1.pdf?ts=1698771279569&ref_url=https%253A%252F%252Fwww.ti.com%252Fsitesearch%252Fen-us%252Fdocs%252Funiversalsearch.tsp%253FlangPref%253Den-US%2526searchTerm%253DUCC14141QDWNRQ1%2526nr%253D3; Height: 3.55mm; Manufacturer_Part_Number: UCC14141QDWNRQ1; Mouser Part Number: 595-UCC14141QDWNRQ1; Mouser Price/Stock: https://www.mouser.co.uk/ProductDetail/Texas-Instruments/UCC14141QDWNRQ1?qs=HoCaDK9Nz5fMbqXhrb3e4A%3D%3D; Arrow Part Number: UCC14141QDWNRQ1; Arrow Price/Stock: https://www.arrow.com/en/products/ucc14141qdwnrq1/texas-instruments?utm_currency=USD&region=nac
R1 R2 R6 R22 = RP73PF1E249KBTD: as R4 on sheet Driver; Part Number: RP73PF1E249KBTD; ComponentLink1Description: Datasheet; ComponentLink1URL: https://www.te.com/commerce/DocumentDelivery/DDEController?Action=srchrtrv&DocNm=1773272&DocType=DS&DocLang=English; ComponentLink2Description: DigiKey Link; ComponentLink2URL: https://www.digikey.com/en/products/detail/te-connectivity-passive-product/RP73PF1E249KBTD/8261091; Composition: Thin Film; Device Package: 0402 (1005 Metric); Height - Seated (Max): 0.014" (0.35mm); LastUpdated: 2/9/2024 8:30:24 PM; Lifecycle Status: Active; Minimum Order: 1; Number of Terminations: 2; Operating Temperature: -55°C ~ 155°C; Package / Case: 0402 (1005 Metric); Packaging: TapeAndReel; PartId: 2418; Part Status: Active; Price: 0.07; Resistance: 249 kOhms; Series: RP73, Holsworthy; Size / Dimension: 0.039" L x 0.020" W (1.00mm x 0.50mm); Supplier 1: DigiKey; Supplier Part Number 1: A127549CT-ND; Supplier Device Package: 0402; Tolerance: ±0.1%

## Sheet HallConnector.SchDoc
size A; SheetNumber: 4; SheetTotal: 9
Used 3 times, as channels U_HallConnectorA, U_HallConnectorB, U_HallConnectorC. Parts and nets are listed once, with the designators drawn on the sheet.
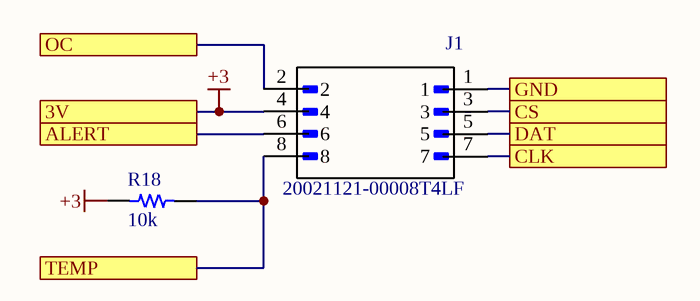
[diagram p3: HallConnector.SchDoc]

### Parts
J1  20021121-00008T4LF  [*AMPHENOL_20021121-00008T4LF]
R18  10k  [RES 0402_1005]

### Ports
3V, ALERT, CLK, CS, DAT, GND, OC, TEMP

### Nets
+3: J1.4 R18.1 ; port 3V
ALERT: J1.6 ; port ALERT
CLK: J1.7 ; port CLK
CS: J1.3 ; port CS
DAT: J1.5 ; port DAT
GND: J1.1 ; port GND
OC: J1.2 ; port OC
TEMP: J1.8 R18.2 ; port TEMP

### Channels
U_HallConnectorA: designators end in _U_HallConnectorA; ports 3V=3V ALERT=NetJ1_U_HallConnectorA_6 CLK=NetJ1_U_HallConnectorA_7 CS=NetJ1_U_HallConnectorA_3 DAT=NetJ1_U_HallConnectorA_5 GND=GND OC=NetJ1_U_HallConnectorA_2 TEMP=NetJ1_U_HallConnectorA_8
U_HallConnectorB: designators end in _U_HallConnectorB; ports 3V=3V ALERT=NetJ1_U_HallConnectorB_6 CLK=NetJ1_U_HallConnectorB_7 CS=NetJ1_U_HallConnectorB_3 DAT=NetJ1_U_HallConnectorB_5 GND=GND OC=NetJ1_U_HallConnectorB_2 TEMP=NetJ1_U_HallConnectorB_8
U_HallConnectorC: designators end in _U_HallConnectorC; ports 3V=3V ALERT=NetJ1_U_HallConnectorC_6 CLK=NetJ1_U_HallConnectorC_7 CS=NetJ1_U_HallConnectorC_3 DAT=NetJ1_U_HallConnectorC_5 GND=GND OC=NetJ1_U_HallConnectorC_2 TEMP=NetJ1_U_HallConnectorC_8

### Library data of the parts
R18 = RP73PF1E249KBTD: as R4 on sheet Driver; Part Number: RP73PF1E249KBTD; ComponentLink1Description: Datasheet; ComponentLink1URL: https://www.te.com/commerce/DocumentDelivery/DDEController?Action=srchrtrv&DocNm=1773272&DocType=DS&DocLang=English; ComponentLink2Description: DigiKey Link; ComponentLink2URL: https://www.digikey.com/en/products/detail/te-connectivity-passive-product/RP73PF1E249KBTD/8261091; Composition: Thin Film; Device Package: 0402 (1005 Metric); Height - Seated (Max): 0.014" (0.35mm); LastUpdated: 2/9/2024 8:30:24 PM; Lifecycle Status: Active; Minimum Order: 1; Number of Terminations: 2; Operating Temperature: -55°C ~ 155°C; Package / Case: 0402 (1005 Metric); Packaging: TapeAndReel; PartId: 2418; Part Status: Active; Price: 0.07; Resistance: 249 kOhms; Series: RP73, Holsworthy; Size / Dimension: 0.039" L x 0.020" W (1.00mm x 0.50mm); Supplier 1: DigiKey; Supplier Part Number 1: A127549CT-ND; Supplier Device Package: 0402; Tolerance: ±0.1%
J1 = 20021121-00008T4LF: Value: *

## Sheet Gate Connector.SchDoc
size A; SheetNumber: 5; SheetTotal: 9
Used 7 times, as channels U_Gate ConnectorAB, U_Gate ConnectorAA, U_Gate ConnectorBB, U_Gate ConnectorBA, U_Gate ConnectorCB, U_Gate ConnectorCA, U_Gate Connector. Parts and nets are listed once, with the designators drawn on the sheet.
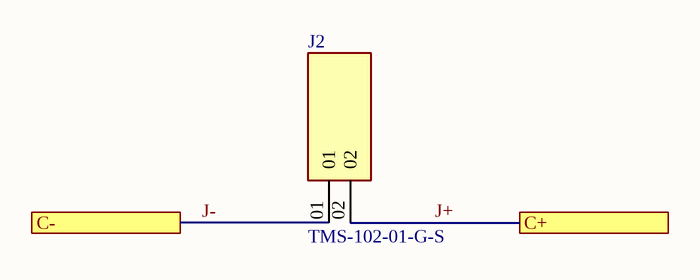
[diagram p4: Gate Connector.SchDoc]

### Parts
J2  TMS-102-01-G-S  [SAMTEC_TMS-102-01-G-S]

### Ports
C+, C-

### Nets
J+: J2.02 ; port C+
J-: J2.01 ; port C-

### Channels
U_Gate ConnectorAB: designators end in _U_Gate_ConnectorAB; ports C+=J+ C-=J-
U_Gate ConnectorAA: designators end in _U_Gate_ConnectorAA; ports C+=J+ C-=J-
U_Gate ConnectorBB: designators end in _U_Gate_ConnectorBB; ports C+=J+ C-=J-
U_Gate ConnectorBA: designators end in _U_Gate_ConnectorBA; ports C+=J+ C-=J-
U_Gate ConnectorCB: designators end in _U_Gate_ConnectorCB; ports C+=J+ C-=HV_TIE
U_Gate ConnectorCA: designators end in _U_Gate_ConnectorCA; ports C+=J+ C-=J-
U_Gate Connector: designators end in _U_Gate_Connector; ports C+=HV_SENSE C-=HV-

### Library data of the parts
J2 = TMS-102-01-G-S: Connector Header position; MF: Samtec; Package: None; Value: *; Toby_UK-Purchase-URL: https://snapeda.com/shop?store=Toby+UK&id=564083; Availability: Unavailable; SnapEDA_Link: https://www.snapeda.com/parts/TMS-102-01-G-S/Samtec%20Inc./view-part/564083/?ref=snap; Price: None; MP: TMS-102-01-G-S

## Sheet Output Connector.SchDoc
size A; SheetNumber: 6; SheetTotal: 9
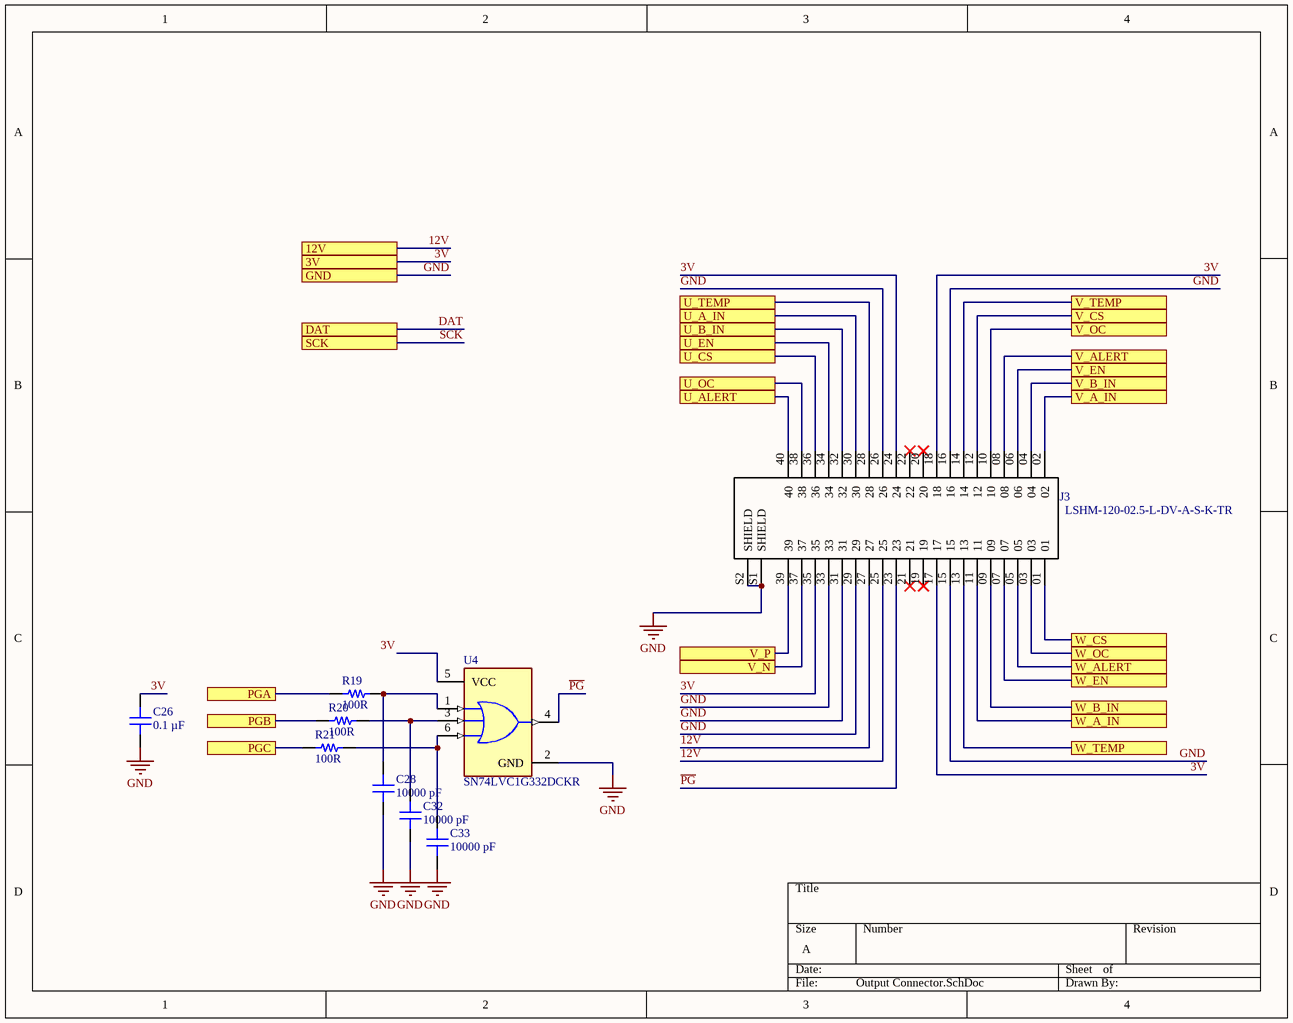
[diagram p5: Output Connector.SchDoc]

### Parts
C26  0.1 µF  [CAP 0603_1608]
C28  10000 pF  [CAP 0402_1005]
C32  10000 pF  [CAP 0402_1005]
C33  10000 pF  [CAP 0402_1005]
J3  LSHM-120-02.5-L-DV-A-S-K-TR  [*SAMTEC_LSHM-120-02.5-L-DV-A-S-K-TR_LSHM-120-02.5-L-DV-A-S-K-TR(Primary)]
R19  100R  [RES 0402_1005]
R20  100R  [RES 0402_1005]
R21  100R  [RES 0402_1005]
U4  SN74LVC1G332DCKR  [FP-DCK0006A-MFG]

### Ports
3V, 12V, DAT, GND, PGA, PGB, PGC, SCK, U_A_IN, U_ALERT, U_B_IN, U_CS, U_EN, U_OC, U_TEMP, V_A_IN, V_ALERT, V_B_IN, V_CS, V_EN, V_N, V_OC, V_P, V_TEMP, W_A_IN, W_ALERT, W_B_IN, W_CS, W_EN, W_OC, W_TEMP

### Nets
3V: C26.2 J3.17 J3.18 J3.24 J3.35 U4.5(VCC) ; port 3V
12V: J3.25 J3.27 ; port 12V
GND: C26.1 C28.1 C32.1 C33.1 J3.15 J3.16 J3.26 J3.29 J3.31 J3.33 J3.S1(SHIELD) J3.S2(SHIELD) U4.2(GND) ; port GND
DAT: port DAT
FAULT: R19.1 ; port PGA
FAULT: R21.1 ; port PGC  [a separate net that carries the same name]
FAULT: R20.1 ; port PGB  [a separate net that carries the same name]
~{PG}: J3.23 U4.4(Y)
SCK: port SCK
V_N: J3.37 ; port V_N
V_P: J3.39 ; port V_P
NetC28_2: C28.2 R19.2 U4.1(A)
NetC32_2: C32.2 R20.2 U4.3(B)
NetC33_2: C33.2 R21.2 U4.6(C)
NetJ1_U_HallConnectorA_2: J3.38 ; port U_OC
NetJ1_U_HallConnectorA_3: J3.36 ; port U_CS
NetJ1_U_HallConnectorA_6: J3.40 ; port U_ALERT
NetJ1_U_HallConnectorA_8: J3.28 ; port U_TEMP
NetJ1_U_HallConnectorB_2: J3.10 ; port V_OC
NetJ1_U_HallConnectorB_3: J3.12 ; port V_CS
NetJ1_U_HallConnectorB_6: J3.08 ; port V_ALERT
NetJ1_U_HallConnectorB_8: J3.14 ; port V_TEMP
NetJ1_U_HallConnectorC_2: J3.03 ; port W_OC
NetJ1_U_HallConnectorC_3: J3.01 ; port W_CS
NetJ1_U_HallConnectorC_6: J3.05 ; port W_ALERT
NetJ1_U_HallConnectorC_8: J3.13 ; port W_TEMP
NetJ3_02: J3.02 ; port V_A_IN
NetJ3_04: J3.04 ; port V_B_IN
NetJ3_06: J3.06 ; port V_EN
NetJ3_07: J3.07 ; port W_EN
NetJ3_09: J3.09 ; port W_B_IN
NetJ3_11: J3.11 ; port W_A_IN
NetJ3_30: J3.30 ; port U_A_IN
NetJ3_32: J3.32 ; port U_B_IN
NetJ3_34: J3.34 ; port U_EN

Not connected (* = marked no-connect by the designer): J3 19* 20* 21* 22*

### Library data of the parts
C26 = C0603C104K5RAC7411: as C3 on sheet Bias_High; Part Number: C0603C104K5RAC7411; Capacitance: 0.1 µF; Applications: Bypass, Decoupling; componentlink1description: Datasheet; componentlink1url: https://api.kemet.com/component-edge/download/datasheet/C0603C104K5RAC7411.pdf; componentlink2description: DigiKey Link; componentlink2url: https://www.digikey.com/en/products/detail/kemet/C0603C104K5RAC7411/3317013; Device Package: 0603 (1608 Metric); lastupdated: 2/9/2024 8:10:30 PM; Lifecycle Status: Active; Minimum Order: 1; Mounting Type: Surface Mount, MLCC; Operating Temperature: -55°C ~ 125°C; Package / Case: 0603 (1608 Metric); packaging: TapeAndReel; partid: 2233; Part Status: Active; price: 0.01; series: SMD Comm X7R; Size / Dimension: 0.063" L x 0.031" W (1.60mm x 0.80mm); Supplier 1: DigiKey; Supplier Part Number 1: 399-C0603C104K5RAC7411CT-ND; Temperature Coefficient: X7R; Thickness (Max): 0.035" (0.90mm); value: 0.1 µF; Voltage - Rated: 50V
C28 C32 C33 = C0402C103K4RECAUTO: CAP CER 10000PF 16V X7R 0402; manufacturer: KEMET; Tolerance: ±10%; Part Number: C0402C103K4RECAUTO; Capacitance: 10000 pF; Applications: Automotive, ESD Protection; componentlink1description: Datasheet; componentlink1url: https://api.kemet.com/component-edge/download/datasheet/C0402C103K4RECAUTO.pdf; componentlink2description: DigiKey Link; componentlink2url: https://www.digikey.com/en/products/detail/kemet/C0402C103K4RECAUTO/8640470; Device Package: 0402 (1005 Metric); lastupdated: 2/9/2024 8:04:38 PM; Lifecycle Status: Active; Minimum Order: 1; Mounting Type: Surface Mount, MLCC; Operating Temperature: -55°C ~ 125°C; Package / Case: 0402 (1005 Metric); packaging: TapeAndReel; partid: 1725; Part Status: Active; price: 0.01; Ratings: AEC-Q200; series: ESD SMD Auto X7R; Size / Dimension: 0.039" L x 0.020" W (1.00mm x 0.50mm); Supplier 1: DigiKey; Supplier Part Number 1: 399-17876-1-ND; Temperature Coefficient: X7R; Thickness (Max): 0.022" (0.55mm); value: 10000 pF; Voltage - Rated: 16V
R19-R21 = RP73PF1E249KBTD: as R4 on sheet Driver; Part Number: RP73PF1E249KBTD; ComponentLink1Description: Datasheet; ComponentLink1URL: https://www.te.com/commerce/DocumentDelivery/DDEController?Action=srchrtrv&DocNm=1773272&DocType=DS&DocLang=English; ComponentLink2Description: DigiKey Link; ComponentLink2URL: https://www.digikey.com/en/products/detail/te-connectivity-passive-product/RP73PF1E249KBTD/8261091; Composition: Thin Film; Device Package: 0402 (1005 Metric); Height - Seated (Max): 0.014" (0.35mm); LastUpdated: 2/9/2024 8:30:24 PM; Lifecycle Status: Active; Minimum Order: 1; Number of Terminations: 2; Operating Temperature: -55°C ~ 155°C; Package / Case: 0402 (1005 Metric); Packaging: TapeAndReel; PartId: 2418; Part Status: Active; Price: 0.07; Resistance: 249 kOhms; Series: RP73, Holsworthy; Size / Dimension: 0.039" L x 0.020" W (1.00mm x 0.50mm); Supplier 1: DigiKey; Supplier Part Number 1: A127549CT-ND; Supplier Device Package: 0402; Tolerance: ±0.1%
U4 = CMP-0859-00464-4: IC GATE OR 1CH 3-INP SC70-6; Manufacturer: Texas Instruments; Min Supply Voltage: 1.65V; Number Of Circuits: 1; Nominal Supply Current: 10uA; Number Of Inputs: 3; Max Supply Voltage: 5.5V; Propagation Delay: 20ns; Standoff Height: 0mm; Logic Function Desc: Non-Inverting; Manufacturer Part Number: SN74LVC1G332DCKR; Automotive: No; Temperature: -40°C to +125°C; Device Class L1: Integrated Circuits (ICs); ComponentLink2URL: http://www.ti.com/lit/ds/symlink/sn74lvc1g332.pdf; RoHS: TRUE; Digikey Description: IC GATE OR 1CH 3-INP SC70-6; Octopart: https://octopart.com/sn74lvc1g332dckr-texas+instruments-464861; Ambient Temperature Range Low: -40°C; Number Of Outputs: 1; Height: 1.1mm; Device Class L2: Logic ICs; Mouser Description: Logic Gates Single 3-Input Pos- OR Gate; ComponentLink2Description: Datasheet; Package: DCK0006A; Temperature Range Low: -40°C; Ambient Temperature Range High: +125°C; Temperature Range High: +125°C; Category: IC; Device Class L3: Logic Gates; Lead Free: Yes
J3 = LSHM-120-02.5-L-DV-A-S-K-TR: Value: *